# EasyEDA schematic schematic.json
TITLE: Sheet_1; REV: 1.0; Date: 2021-08-26; Sheet: 1/1; Drawn By: tommylutz; Company: Your Company
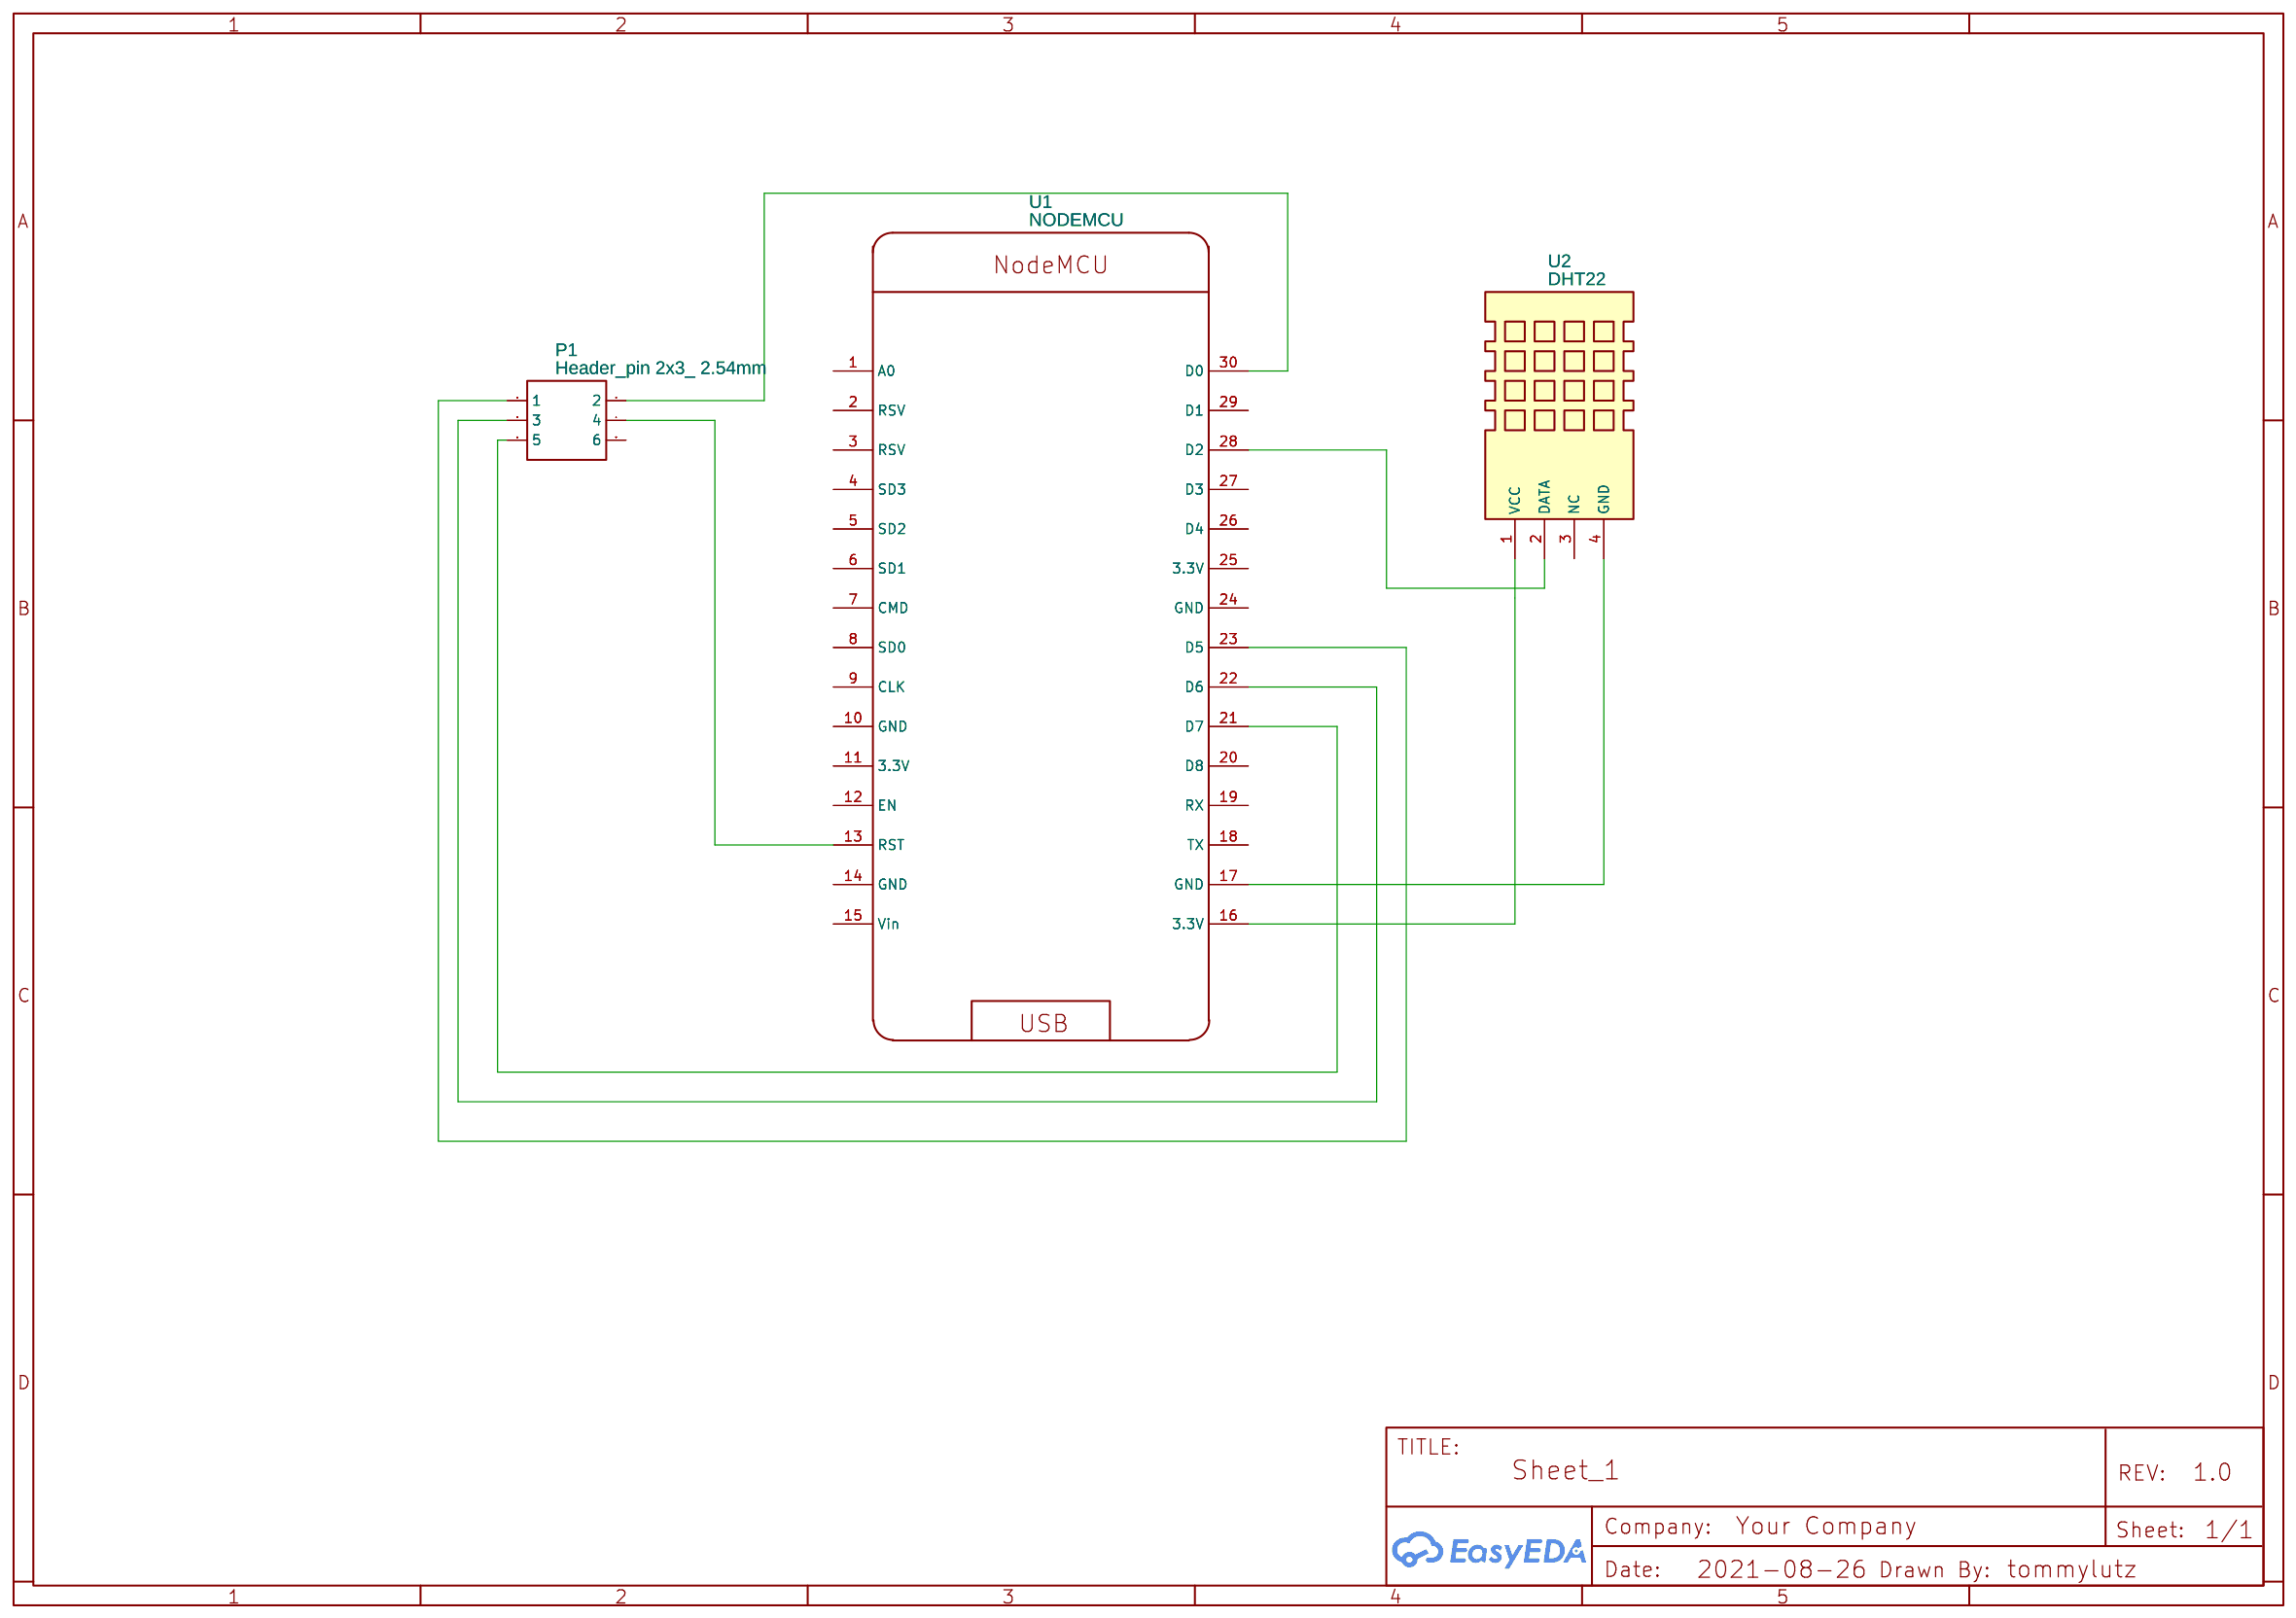
[diagram p0: schematic sheet]

## Parts
P1  Header_pin 2x3_ 2.54mm  [HEADER_PIN 2X3_2.54MM]
U1  NODEMCU  [NODEMCU]
U2  DHT22  [DHT22_AM2303_VERT]

## Library data of the parts
P1 = Header_pin 2x3_ 2.54mm: Supplier: LCSC; Manufacturer: BOOMELE; Manufacturer Part: Double Rows2.54mm2*2pHeaders  Pins; Supplier Part: C66690; Contributor: Ethan22
U1 = NODEMCU: Contributor: nrn.nitb
U2 = DHT22: Digital-output relative humidity & temperature sensor/module; sourceId: GkiDrp9vf; Supplier Part: PRODUCT ID: 385; Supplier: AdaFruit; Voltage: 3.3V - 5.5V; Mounted: Yes; Manufacturer: Aosong (Guangzhou) Electronics Co., Ltd.; link: https://cdn-shop.adafruit.com/datasheets/DHT22.pdf

## Nets
Net-(P1-1): P1.1 U1.23(D5)
Net-(P1-2): P1.2 U1.30(D0)
Net-(P1-3): P1.3 U1.22(D6)
Net-(P1-4): P1.4 U1.13(RST)
Net-(P1-5): P1.5 U1.21(D7)
Net-(U1-16): U1.16(3.3V) U2.1(VCC)
Net-(U1-17): U1.17(GND) U2.4(GND)
Net-(U1-28): U1.28(D2) U2.2(DATA)

Not connected (* = marked no-connect by the designer): P1 6; U1 1(A0) 2(RSV) 3(RSV) 4(SD3) 5(SD2) 6(SD1) 7(CMD) 8(SD0) 9(CLK) 10(GND) 11(3.3V) 12(EN) 14(GND) 15(Vin) 18(TX) 19(RX) 20(D8) 24(GND) 25(3.3V) 26(D4) 27(D3) 29(D1); U2 3(NC)
